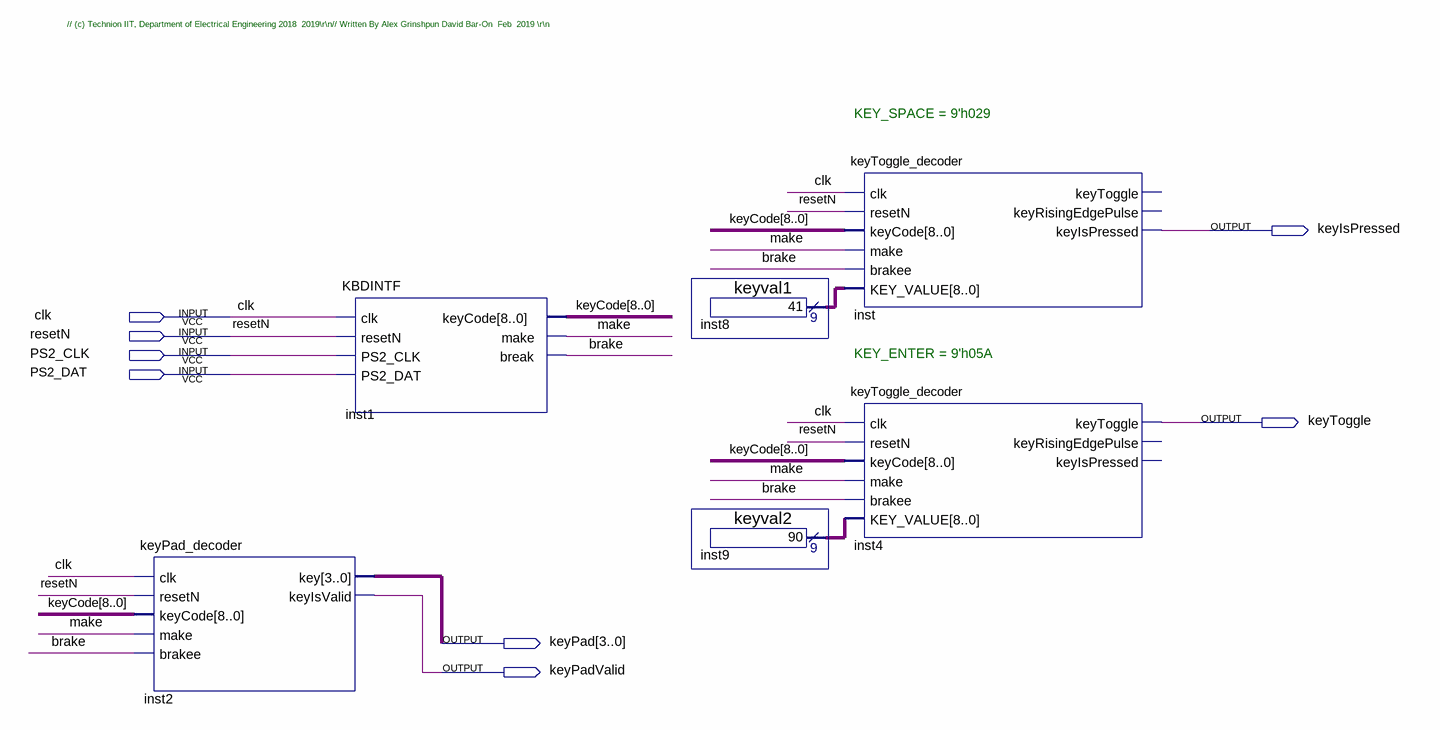
[diagram p0: schematic sheet]
// Quartus schematic TOP_KBD_DEMOALL.bdf as structural Verilog: 6 symbols, 8 pins
module TOP_KBD_DEMOALL (
  input  clk,
  input  resetN,
  input  PS2_CLK,
  input  PS2_DAT,
  output keyIsPressed,
  output keyToggle,
  output [3:0] keyPad,
  output keyPadValid
);

  wire brake, make;
  wire [8:0] inst8_result, inst9_result, keyCode;

  keyPad_decoder inst2 (
    .clk(clk), .resetN(resetN), .keyCode(keyCode), .make(make), .brakee(brake), .key(keyPad),
    .keyIsValid(keyPadValid));
  KBDINTF inst1 (
    .clk(clk), .resetN(resetN), .PS2_CLK(PS2_CLK), .PS2_DAT(PS2_DAT), .keyCode(keyCode), .make(make),
    .\break (brake));
  keyval1 inst8 (.result(inst8_result));
  keyval2 inst9 (.result(inst9_result));
  keyToggle_decoder inst (
    .clk(clk), .resetN(resetN), .keyCode(keyCode), .make(make), .brakee(brake), .KEY_VALUE(inst8_result),
    .keyIsPressed(keyIsPressed));  // open: keyToggle, keyRisingEdgePulse
  keyToggle_decoder inst4 (
    .clk(clk), .resetN(resetN), .keyCode(keyCode), .make(make), .brakee(brake), .KEY_VALUE(inst9_result),
    .keyToggle(keyToggle));  // open: keyRisingEdgePulse, keyIsPressed

  // Notes on the sheet:
  //   // (c) Technion IIT, Department of Electrical Engineering 2018  2019\r\n// Written By Alex Grinshpun David Bar-On  Feb  2019 \r\n
  //   KEY_SPACE = 9'h029
  //   KEY_ENTER = 9'h05A
endmodule
